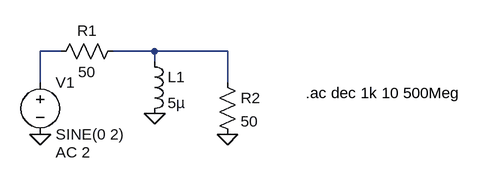
[diagram p0: schematic Lind.asc]
Lind.asc, the LTspice schematic file:
Version 4
SHEET 1 880 680
WIRE 96 128 64 128
WIRE 240 128 176 128
WIRE 352 128 240 128
WIRE 240 144 240 128
WIRE 64 176 64 128
WIRE 352 176 352 128
FLAG 64 256 0
FLAG 352 256 0
FLAG 240 224 0
SYMBOL voltage 64 160 R0
WINDOW 123 24 124 Left 2
WINDOW 39 0 0 Left 0
SYMATTR InstName V1
SYMATTR Value SINE(0 2)
SYMATTR Value2 AC 2
SYMBOL ind 224 128 R0
SYMATTR InstName L1
SYMATTR Value 5µ
SYMBOL res 192 112 R90
WINDOW 0 0 56 VBottom 2
WINDOW 3 32 56 VTop 2
SYMATTR InstName R1
SYMATTR Value 50
SYMBOL res 336 160 R0
SYMATTR InstName R2
SYMATTR Value 50
TEXT 472 192 Left 2 !.ac dec 1k 10 500Meg

The netlist it stands for:
* Lind.asc
V1 N001 0 SINE(0 2) AC 2
L1 N002 0 5µ
R1 N002 N001 50
R2 N002 0 50
.ac dec 1k 10 500Meg
.backanno
.end